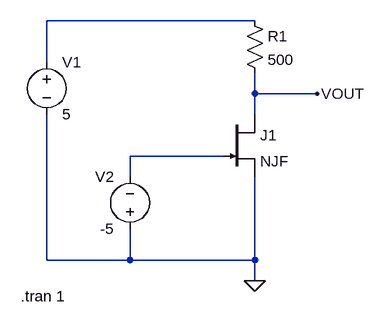
[diagram p0: schematic Draft1.asc]
Draft1.asc, the LTspice schematic file:
Version 4.1
SHEET 1 880 680
WIRE 432 48 112 48
WIRE 112 112 112 48
WIRE 432 160 432 128
WIRE 528 160 432 160
WIRE 432 192 432 160
WIRE 384 256 240 256
WIRE 240 288 240 256
WIRE 112 416 112 192
WIRE 240 416 240 368
WIRE 240 416 112 416
WIRE 432 416 432 288
WIRE 432 416 240 416
WIRE 432 448 432 416
FLAG 432 448 0
FLAG 528 160 VOUT
SYMBOL voltage 112 96 R0
SYMATTR InstName V1
SYMATTR Value 5
SYMBOL voltage 240 384 R180
WINDOW 0 24 96 Left 2
WINDOW 3 24 16 Left 2
SYMATTR InstName V2
SYMATTR Value -5
SYMBOL res 416 32 R0
SYMATTR InstName R1
SYMATTR Value 500
SYMBOL njf 384 192 R0
SYMATTR InstName J1
TEXT 72 472 Left 2 !.tran 1

The netlist it stands for:
* Draft1.asc
V1 N001 0 5
V2 0 N002 -5
R1 N001 VOUT 500
J1 VOUT N002 0 NJF
.model NJF NJF
.model PJF PJF
.lib standard.jft
.tran 1
.backanno
.end